# EAGLE design esp32Layout1 (EAGLE 9.6.2)
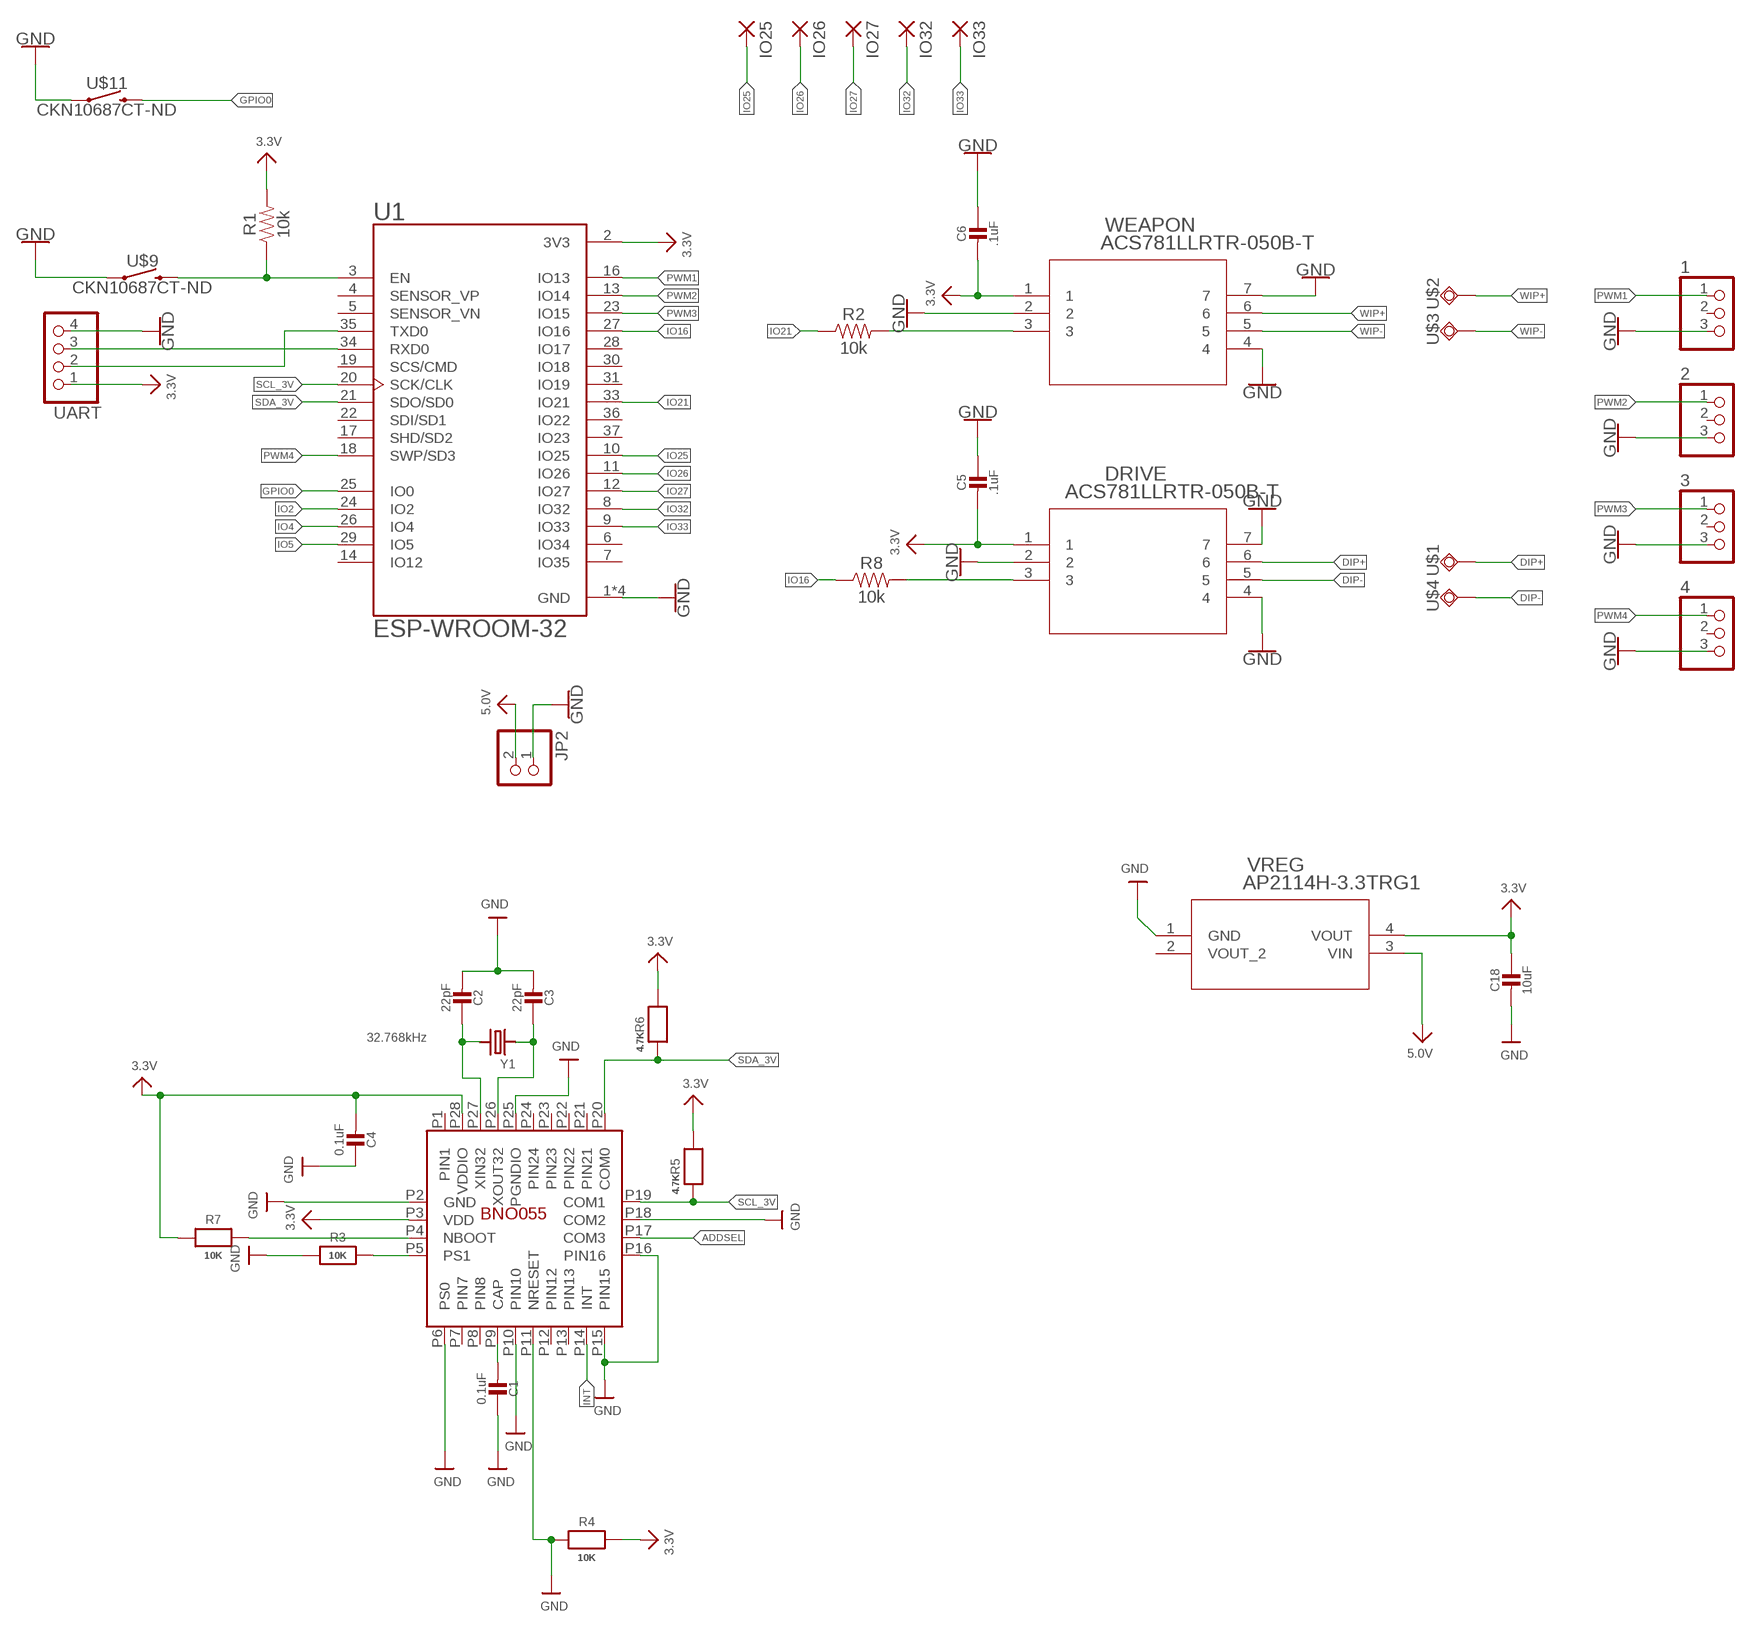
[diagram p0: schematic, sheet 1]

## Parts
1  PINHD-1X3  [1X03]
2  PINHD-1X3  [1X03]
3  PINHD-1X3  [1X03]
4  PINHD-1X3  [1X03]
BNO055  BNO055  [BNO055]
C1  0.1uF  CAP_CERAMIC0805-NOOUTLINE  [0805-NO]
C2  22pF  CAP_CERAMIC0805-NOOUTLINE  [0805-NO]
C3  22pF  CAP_CERAMIC0805-NOOUTLINE  [0805-NO]
C4  0.1uF  CAP_CERAMIC0805-NOOUTLINE  [0805-NO]
C5  .1uF  CAP_CERAMIC0805_10MGAP  [0805_10MGAP]
C6  .1uF  CAP_CERAMIC0805_10MGAP  [0805_10MGAP]
C18  10uF  CAP_CERAMIC0805_10MGAP  [0805_10MGAP]
DRIVE  ACS781LLRTR-050B-T  [PSOF7_ACS781LLRTR-050B-T_ALM]
IO25  SMD2  [SMD1,27-2,54]
IO26  SMD2  [SMD1,27-2,54]
IO27  SMD2  [SMD1,27-2,54]
IO32  SMD2  [SMD1,27-2,54]
IO33  SMD2  [SMD1,27-2,54]
JP2  PINHD-1X2  [1X02]
R1  10k  10KOHM-0603-1/10W-1%  [0603]
R2  10k  10KOHM-0603-1/10W-1%  [0603]
R3  10K  RESISTOR0805_NOOUTLINE  [0805-NO]
R4  10K  RESISTOR0805_NOOUTLINE  [0805-NO]
R5  4.7K  RESISTOR0805_NOOUTLINE  [0805-NO]
R6  4.7K  RESISTOR0805_NOOUTLINE  [0805-NO]
R7  10K  RESISTOR0805_NOOUTLINE  [0805-NO]
R8  10k  10KOHM-0603-1/10W-1%  [0603]
U1  ESP-WROOM-32  [MODULE_ESP-WROOM-32]
U$1  HCURR_PAD  [HCURR_PAD]
U$2  HCURR_PAD  [HCURR_PAD]
U$3  HCURR_PAD  [HCURR_PAD]
U$4  HCURR_PAD  [HCURR_PAD]
U$9  CKN10687CT-ND  [CKN10687CT-ND]
U$11  CKN10687CT-ND  [CKN10687CT-ND]
UART  PINHD-1X4  [1X04]
VREG  AP2114H-3.3TRG1  [SOT-223_DIO]
WEAPON  ACS781LLRTR-050B-T  [PSOF7_ACS781LLRTR-050B-T_ALM]
Y1  32.768kHz  CRYSTAL8.0X3.8  [CRYSTAL_8X3.8]

## Nets
3.3V: BNO055.P3(VDD) BNO055.P28(VDDIO) C4.2 C18.1 R1.2 R4.2 R5.2 R6.2 R7.1 U1.2(3V3) UART.1 VREG.4(VOUT)
5.0V: JP2.2 VREG.3(VIN)
ADDSEL: BNO055.P17(COM3)
DIP+: DRIVE.6 U$1.P$1(TP)
DIP-: DRIVE.5 U$4.P$1(TP)
GND [New Class]: 1.3 2.3 3.3 4.3 BNO055.P2(GND) BNO055.P6(PS0) BNO055.P10(PIN10) BNO055.P11(NRESET) BNO055.P15(PIN15) BNO055.P16(PIN16) BNO055.P18(COM2) BNO055.P25(PGNDIO) C1.1 C2.2 C3.2 C4.1 C5.1 C6.1 C18.2 DRIVE.2 DRIVE.4 DRIVE.7 JP2.1 R3.1 R4.1 U1.1(GND) U1.1.1(GND) U1.15(GND) U1.38(GND) U$9.P$1 U$9.P$2 U$11.P$1 U$11.P$2 UART.4 VREG.1(GND) WEAPON.2 WEAPON.4 WEAPON.7
GPIO0: U1.25(IO0) U$11.P$3 U$11.P$4
INT: BNO055.P14(INT)
IO2: U1.24(IO2)
IO4: U1.26(IO4)
IO5: U1.29(IO5)
IO16: R8.1 U1.27(IO16)
IO21: R2.1 U1.33(IO21)
IO25: IO25.1(P) U1.10(IO25)
IO26: IO26.1(P) U1.11(IO26)
IO27: IO27.1(P) U1.12(IO27)
IO32: IO32.1(P) U1.8(IO32)
IO33: IO33.1(P) U1.9(IO33)
N$1: BNO055.P5(PS1) R3.2
N$2 [New Class]: R1.1 U1.3(EN) U$9.P$3 U$9.P$4
N$3 [New Class]: U1.35(TXD0) UART.2
N$4 [New Class]: U1.34(RXD0) UART.3
N$5: R2.2 WEAPON.3
N$6: BNO055.P9(CAP) C1.2
N$7: BNO055.P27(XIN32) C2.1 Y1.P$4
N$8: BNO055.P26(XOUT32) C3.1 Y1.P$1
N$9: BNO055.P4(NBOOT) R7.2
N$10: DRIVE.3 R8.2
N$11: C5.2 DRIVE.1 ; supply symbol labelled 3.3V
N$12 [New Class]: C6.2 WEAPON.1 ; supply symbol labelled 3.3V
PWM1: 1.1 U1.16(IO13)
PWM2: 2.1 U1.13(IO14)
PWM3: 3.1 U1.23(IO15)
PWM4: 4.1 U1.18(SWP/SD3)
SCL_3V: BNO055.P19(COM1) R5.1 U1.20(SCK/CLK)
SDA_3V: BNO055.P20(COM0) R6.1 U1.21(SDO/SD0)
WIP+: U$2.P$1(TP) WEAPON.6
WIP-: U$3.P$1(TP) WEAPON.5
Unconnected: 1.2 2.2 3.2 4.2 BNO055.P1(PIN1) BNO055.P7(PIN7) BNO055.P8(PIN8) BNO055.P12(PIN12) BNO055.P13(PIN13) BNO055.P21(PIN21) BNO055.P22(PIN22) BNO055.P23(PIN23) BNO055.P24(PIN24) U1.4(SENSOR_VP) U1.5(SENSOR_VN) U1.6(IO34) U1.7(IO35) U1.14(IO12) U1.17(SHD/SD2) U1.19(SCS/CMD) U1.22(SDI/SD1) U1.28(IO17) U1.30(IO18) U1.31(IO19) U1.36(IO22) U1.37(IO23) VREG.2(VOUT_2)

## Library data of the parts
1-4 = pinhead:PINHD-1X3: PIN HEADER
BNO055 = Tim Parts:BNO055
C1-C6 C18 = microbuilder:CAP_CERAMIC: Ceramic Capacitors For new designs, use the packages preceded by an '_' character since they are more reliable: The following footprints should be used on most boards: _0402 - Standard footprint for regular board layouts _0603 - Standard footprint for regular board layouts _0805 - Standard footprint for regular board layouts _1206 - Standard footprint for regular board layouts For extremely tight-pitch boards where space is at a premium, the following 'micro-pitch' footprints can be used (smaller pads, no silkscreen outline, etc.): _0402MP - Micro-pitch footprint for very dense/compact boards _0603MP - Micro-pitch footprint for very dense/compact boards _0805MP - Micro-pitch footprint for very dense/compact boards _1206MP - Micro-pitch footprint for very dense/compact boards
DRIVE WEAPON = Bell Parts:ACS781LLRTR-050B-T; BUILT_BY: EMA_Kyle; COPYRIGHT: Copyright (C) 2018 Accelerated Designs. All rights reserved; MANUFACTURER_PART_NUMBER: ACS781LLRTR-050B-T; SOURCELIBRARY: Allegro_Microsystems_Inc_2020-02-13; VENDOR: Allegro Microsystems Inc.
IO25-IO27 IO32 IO33 = wirepad:SMD2: SMD PAD
JP2 = pinhead:PINHD-1X2: PIN HEADER
R1 R2 R8 = SparkFun-Resistors:10KOHM: 10kΩ resistor A resistor is a passive two-terminal electrical component that implements electrical resistance as a circuit element. Resistors act to reduce current flow, and, at the same time, act to lower voltage levels within circuits. - Wikipedia; PROD_ID: RES-00824
R3-R7 = microbuilder:RESISTOR: Resistors For new designs, use the packages preceded by an '_' character since they are more reliable: The following footprints should be used on most boards: _0402 - Standard footprint for regular board layouts _0603 - Standard footprint for regular board layouts _0805 - Standard footprint for regular board layouts _1206 - Standard footprint for regular board layouts For extremely tight-pitch boards where space is at a premium, the following 'micro-pitch' footprints can be used (smaller pads, no silkscreen outline, etc.): _0402MP - Micro-pitch footprint for very dense/compact boards _0603MP - Micro-pitch footprint for very dense/compact boards _0805MP - Micro-pitch footprint for very dense/compact boards _1206MP - Micro-pitch footprint for very dense/compact boards
U1 = ESP-WROOM-32:ESP-WROOM-32: Module: combo; GPIO, I2C x2, I2S x2, SDIO, SPI x3, UART x3; 19.5dBm; AVAILABILITY: Unavailable; DESCRIPTION: WiFi 802.11b/g/n/d/e/i Transceiver Module 2.4GHz Surface Mount; MF: Olimex LTD; MP: ESP-WROOM-32; PACKAGE: Module Olimex LTD; PRICE: None
U$1-U$4 = Bell Parts:HCURR_PAD
U$9 U$11 = Bell Parts:CKN10687CT-ND
UART = pinhead:PINHD-1X4: PIN HEADER
VREG = Bell Parts:AP2114H-3.3TRG1; BUILT_BY: EMA_UL_Team; MANUFACTURER_PART_NUMBER: AP2114H-3.3TRG1; SOURCELIBRARY: DIODESINC_2_2015-08-18; VENDOR: Diodes Inc
Y1 = microbuilder:CRYSTAL: Crystals HC49UP - Surface Mount Crystal 4.0MHz 18pF +/-30ppm Surface Mount Crystal [Digikey: 535-9857-1-ND] 12.0 MHz Surface Mount Crystal [Digikey: 535-9869-6-ND] 25.0 MHz Surface Mount Crystal [Digikey: 535-9078-1-ND] 2.5 x 2.0mm - MEMs SMT Crystal 16.0 MHz 10pF 20ppm 2.5 x 2.0mm Crystal [Digikey -40-85°C: 535-10923-1-ND] 3.2 x 2.5mm - MEMs SMT Crystal 12.0 MHz 8pF 15ppm 3.2 x 2.5mm Crystal [Digikey: -10-70°C: 644-1047-1-ND -40-125°C: 644-1128-1-ND] 40~85°C cheaper: 644-1173-6-ND 16.0 MHz 8pF 15ppm 3.2 x 2.5mm Crystal [Digikey: -10-70°C: 644-1049-1-ND -40-125°C: 644-1129-2-ND]-40~85°C cheaper: 644-1175-6-ND 16.0 MHz 10pF 10ppm 3.2 x 2.5mm Crystal [Digikey: 644-1100-1-ND] 27.12 MHz 18pF 30ppm 3.2 x 2.5mm Crystal [Digikey: 887-1424-1-ND] 27.12MHz 10pF 10ppm 3.2 x 2.5mm Crystal [Digikey: 887-1329-1-ND] 4.9 x 1.8mm - MEMs SMT Crystal 32.768 KHz 12.5pF 20ppm 4.9 x 1.8mm Crystal [Digikey: SE2415CT-ND] 8.0 x 3.8mm - Surface Mount Crystal 32.768kHz 12.5pF 20ppm -40°C-85°C [Digikey: 535-9166-2-ND] Cylinder 32.768KHz Cylinder Crystal (2x6mm body) [Ex. Digikey: 300-8341-2-ND]

## Net classes
1 New Class: width 0.152 mm, drill 0.254 mm, clearance 0.254 mm

## Board
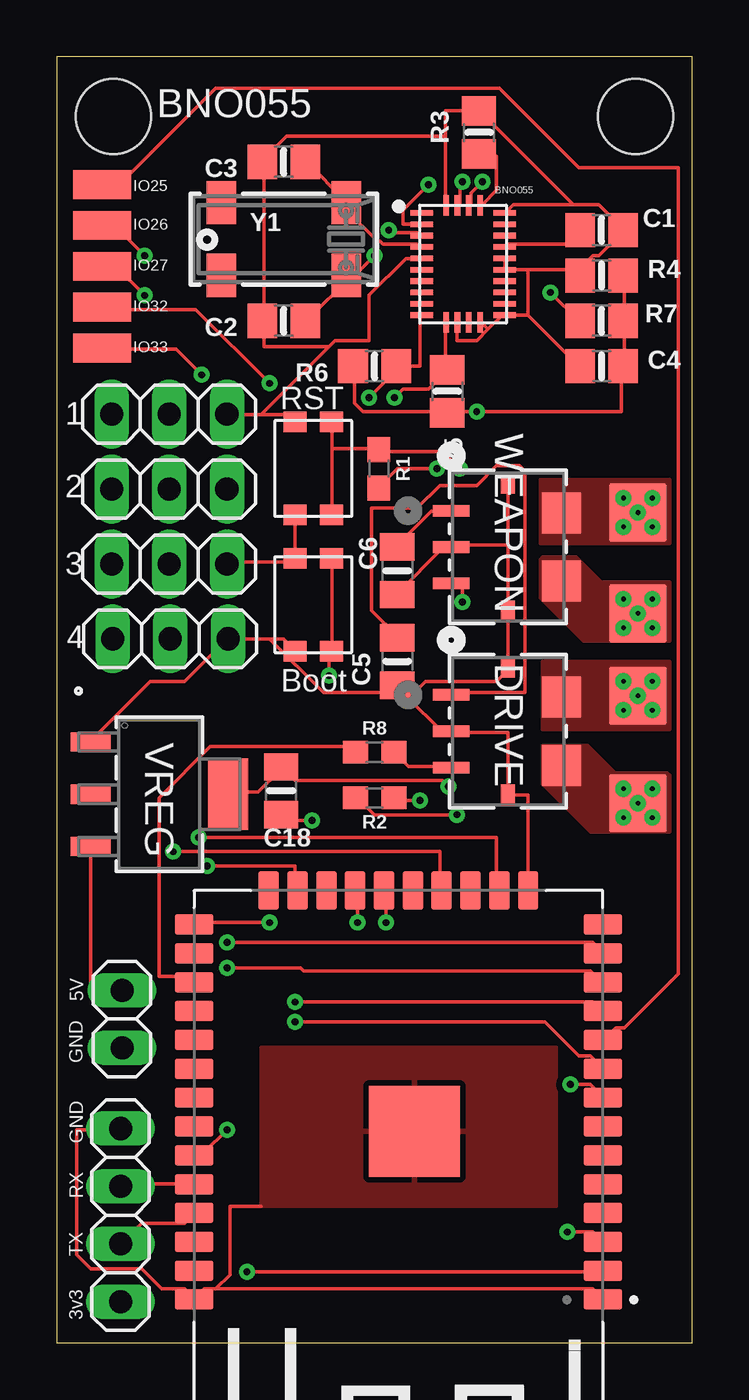
[diagram p1: board, top side]
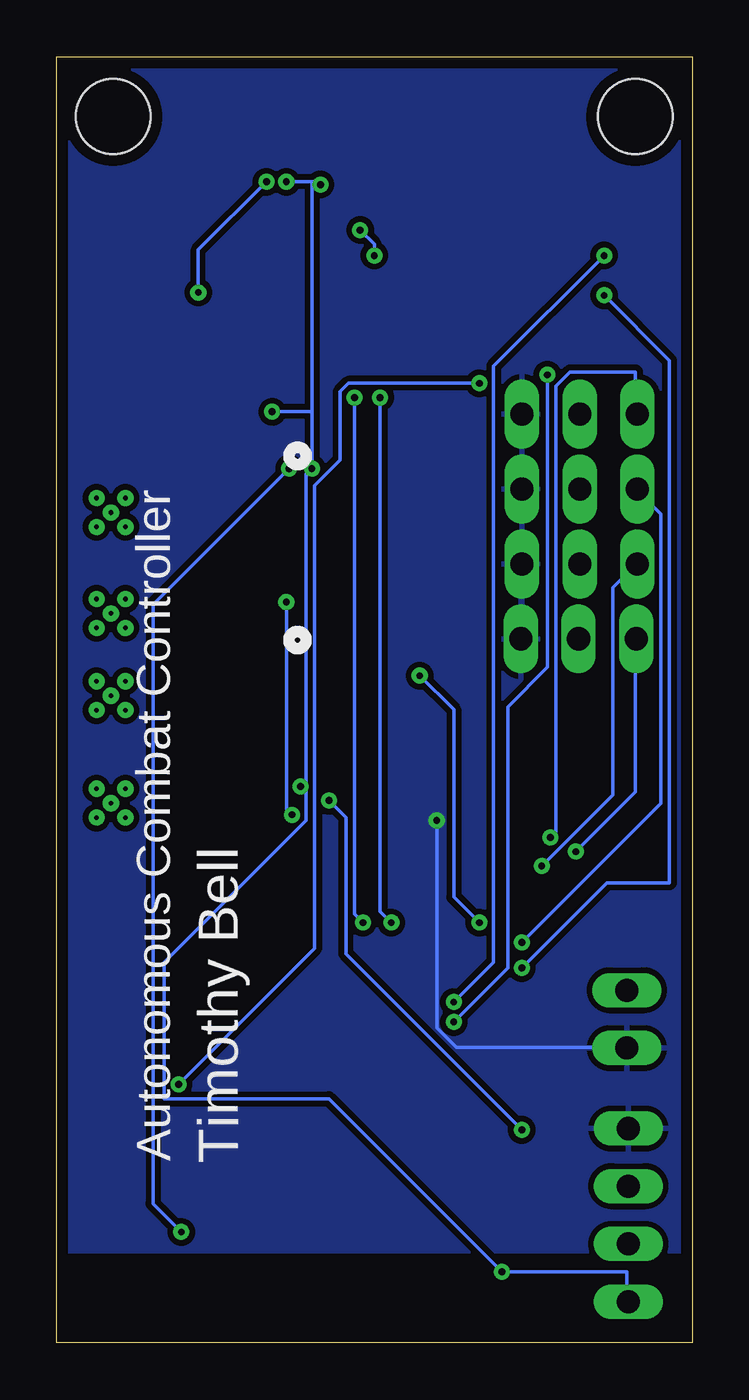
[diagram p2: board, bottom side, seen from below]

Size 27.99 x 56.63 mm. Coordinates in mm from the lower left corner, seen from the top.
Outline: 0,0 27.99,0 27.99,56.63 0,56.63 0,0
Copper layers (1*16): Top 0.035mm / dielectric 1.5mm / Bottom 0.035mm
Design rules "JLC 2 layer DRC": minimum track width 6mil, minimum drill 0.3mm, track to track 6mil, track to pad 6mil, pad to pad 6mil, via to via 6mil, smd to smd 6mil, copper to edge 20mil, drill to drill 6mil, minimum pad ring 10mil, minimum via ring 8mil, stop-mask expansion 4mil, vias tented up to drill 0mil, thermal gap 10mil
Holes 3.3 mm at 2.5,54 25.5,54

### Footprints (pad centres in the part's own frame; a part is rotated, then mirrored left to right if it is on the bottom)
1X03 = drill 1.016 long: 1 -2.54,0; 2 0,0; 3 2.54,0
BNO055 = smd 0.25 x 1: P1 2.25,1.825; P6 2.25,-1.825; P7 1.75,-1.825; P8 1.25,-1.825; P9 0.75,-1.825; P10 0.25,-1.825; P11 -0.25,-1.825; P12 -0.75,-1.825; P13 -1.25,-1.825; P14 -1.75,-1.825; P15 -2.25,-1.825; P20 -2.25,1.825; P21 -1.75,1.825; P22 -1.25,1.825; P23 -0.75,1.825; P24 -0.25,1.825; P25 0.25,1.825; P26 0.75,1.825; P27 1.25,1.825; P28 1.75,1.825 | smd 0.9 x 0.25: P2 2.575,0.75; P3 2.575,0.25; P4 2.575,-0.25; P5 2.575,-0.75; P16 -2.575,-0.75; P17 -2.575,-0.25; P18 -2.575,0.25; P19 -2.575,0.75
0805-NO = smd 1.3 x 1.5: 1 -0.95,0; 2 0.95,0
0805_10MGAP = smd 1.2 x 1.5: 1 -1.05,0; 2 1.05,0
PSOF7_ACS781LLRTR-050B-T_ALM = smd 0.508 x 1.6: 1 -3.2,0; 2 -1.6,0; 3 0,0 | smd 0.889 x 0.61: 4 1.2,2.5; 7 -4.4,2.5 | smd 1.803 x 1.702: 5 -0.1,4.85; 6 -3.1,4.85
SMD1,27-2,54 = smd 1.27 x 2.54: 1 0,0
1X02 = drill 1.016 long: 1 -1.27,0; 2 1.27,0
0603 = smd 1.1 x 1: 1 -0.85,0; 2 0.85,0
MODULE_ESP-WROOM-32 = smd 1.7 x 0.9: 1 -9,8.255; 2 -9,6.985; 3 -9,5.715; 4 -9,4.445; 5 -9,3.175; 6 -9,1.905; 7 -9,0.635; 8 -9,-0.635; 9 -9,-1.905; 10 -9,-3.175; 11 -9,-4.445; 12 -9,-5.715; 13 -9,-6.985; 14 -9,-8.255; 25 9,-8.255; 26 9,-6.985; 27 9,-5.715; 28 9,-4.445; 29 9,-3.175; 30 9,-1.905; 31 9,-0.635; 32 9,0.635; 33 9,1.905; 34 9,3.175; 35 9,4.445; 36 9,5.715; 37 9,6.985; 38 9,8.255 | smd 4 x 4: 1.1 -0.7,0.845 | smd 0.9 x 1.7: 15 -5.715,-9.755; 16 -4.445,-9.755; 17 -3.175,-9.755; 18 -1.905,-9.755; 19 -0.635,-9.755; 20 0.635,-9.755; 21 1.905,-9.755; 22 3.175,-9.755; 23 4.445,-9.755; 24 5.715,-9.755
HCURR_PAD = smd 2.54 x 2.54: P$1 0,0 | drill 0.203 pad 0.406: P$2 -0.635,0.635; P$3 0.635,0.635; P$4 -0.635,-0.635; P$5 0.635,-0.635; P$6 0,0
CKN10687CT-ND = smd 0.9 x 1: P$1 0.45,0.5; P$2 4.55,0.5; P$3 4.55,2.1; P$4 0.45,2.1
1X04 = drill 1.016 long: 1 -3.81,0; 2 -1.27,0; 3 1.27,0; 4 3.81,0
SOT-223_DIO = smd 0.851 x 1.761: 1 -2.3,-3.025; 2 0,-3.025; 3 2.3,-3.025 | smd 3.151 x 1.761: 4 0,3.025
CRYSTAL_8X3.8 = smd 1.3 x 1.9: P$1 -2.75,-1.6; P$2 2.75,-1.6; P$3 2.75,1.6; P$4 -2.75,1.6

### Placement (x,y rotation side)
1  4.95,40.89 0 top
2  4.95,37.59 0 top
3  4.95,34.29 0 top
4  5,31 0 top
BNO055  17.9,47.5 90 top
C1  24,49 180 top
C2  10,45 180 top
C3  10,52 180 top
C4  24,43 0 top
C5  15,30 90 top
C6  15,34 90 top
C18  9.88,24.3 270 top
DRIVE  17.38,25.33 270 top
IO25  2,51 90 top
IO26  2,49.2 90 top
IO27  2,47.4 90 top
IO32  2,45.6 90 top
IO33  2,43.8 90 top
JP2  2.87,14.25 90 top
R1  14.19,38.49 270 top
R2  14,24 180 top
R3  18.6,53.3 270 top
R4  24,47 0 top
R5  17.2,41.9 270 top
R6  14,43 180 top
R7  24,45 180 top
R8  14,26 0 top
U1  15.05,10.16 180 top
U$1  25.6,28.49 0 top
U$2  25.6,36.56 180 top
U$3  25.6,32.12 0 top
U$4  25.6,23.76 0 top
U$9  10,41 270 top
U$11  10,35 270 top
UART  2.81,5.62 90 top
VREG  4.51,24.16 270 top
WEAPON  17.38,33.44 270 top
Y1  10,48.6 180 top

### Tracks (layer width: path | path; a pad name or v marks a point on that pad's centre or on a via)
3.3V  (via drill 0.3)
  Top 0.152: v8.38,3.12 24,3.12 U1.2 | 25,45 25,43 C4.2 24.88,43 24.88,41 v18.5,41 17.25,41 R5.2 17.12,41 13.5,41 13.12,41.38 13.12,43 R6.2 | 25,45 25,47 R4.2 | 25,45 R7.1 | VREG.4 7.62,24.25 8.88,24.25 9.88,25.25 C18.1 10,25.25 10.5,24.75 17,24.75 v17.25,24.5 | v17.88,51.12 17.75,51.12 17.75,50.12 BNO055.P3 | v16.38,51 15.25,49.88 15.25,49.25 BNO055.P28 | v16.75,38.5 15,38.5 14.25,37.75 R1.2
  Bottom 0.152: UART.1 2.88,1.88 2.88,3.12 v8.38,3.12 16,10.75 23.25,10.75 23.25,16.75 17,23 17,24.75 | 16.75,51.12 16.38,51.12 v16.38,51 | 16.75,51.12 v17.88,51.12 | 16.75,51.12 16.75,41 | 16.75,41 v16.75,38.5 17,38.25 17,24.75 | 17,24.75 v17.25,24.5 | 16.75,41 v18.5,41
5.0V
  Top 0.152: VREG.3 1.5,21.75 1.5,15.62 2.75,15.62 JP2.2
DIP+
  pour Top (no thermals): 21.4,30 21.4,27 27,27 27,30
DIP-
  pour Top (no thermals): 21.4,26.3 21.4,24.6 23.5,22.5 27,22.5 27,25 26.9,25.1 24.6,25.1 23.4,26.3
GND  (via drill 0.3)
  Top 0.152: 19.88,35.12 19.88,37.75 WEAPON.7 | 19.88,35.12 17.5,35.12 WEAPON.2 17.38,35 17,35 15,33 C6.1 | 19.88,35.12 WEAPON.4 19.88,32.12 19.88,29.75 DRIVE.7 19.88,29.62 19.38,29.12 16.25,29.12 15.5,28.38 | 15.5,28.38 16.88,27 17.38,27 DRIVE.2 17.5,26.88 19.88,26.88 19.88,24.25 DRIVE.4 20,24.12 20.75,24.12 20.75,20 U1.15 | 15.5,28.38 15,28.88 | 15.5,28.38 C5.1 15,28.88 | 7,2.38 6.5,2.38 6.12,2 U1.38 6,2 5.62,2.38 4.62,2.38 3.75,3.25 1.5,3.25 0.88,3.88 0.88,9.38 2.75,9.38 UART.4 | 7,2.38 7.62,3 7.62,6 9,6 | 7,2.38 23.62,2.38 24,2 U1.1 | 19.75,47.25 19.75,47.75 BNO055.P10 | 20.75,47.25 22.75,47.25 22.88,47.12 | 20.75,47.25 19.75,47.25 | 22.88,47.12 23,47 R4.1 22.88,47.12 | 19.75,47.25 BNO055.P11 | 19,44.62 19.62,45.25 BNO055.P15 20.75,45.25 | 19,44.62 18.5,44.12 17.62,44.12 17.62,44.88 BNO055.P18 | 19,44.62 18.75,44.88 BNO055.P16 | 20.75,45.25 23,43 C4.1 | 20.75,45.25 20.75,47.25 | 17.12,53.12 17.12,54.25 R3.1 18.62,54.25 22.75,50.12 | 17.12,53.12 17.12,50.12 BNO055.P2 | 22.75,50.12 23.88,50.12 25,49 | 22.75,50.12 20.12,50.12 19.75,49.75 BNO055.P6 | 22.88,47.12 23.62,47.88 23.88,47.88 25,49 | 25,49 C1.1 | U$9.P$2 U$11.P$1 10.5,34.5 10.38,34.38 7.5,34.38 3.3 | 9.38,31 4.3 7.5,31 5.62,29.12 4.12,29.12 1.5,26.5 VREG.1 | 9.38,31 10,31 10.5,30.5 U$11.P$2 | 9,40.88 7.5,40.88 1.3 | 9,40.88 10.25,40.88 10.5,40.62 U$9.P$1 | BNO055.P25 15.38,47.75 13.75,46.12 13.75,44.12 12.25,44.12 12,43.88 | 9,40.88 12,43.88 | 9.12,45 9.12,43.88 12,43.88 | 9.12,45 9.12,52 C3.2 9,52 10.12,53.12 17.12,53.12 | 9.12,45 C2.2 | v11.25,23 10.25,23 10,23.25 C18.2 | 15,28.88 14.75,28.62 11.75,28.62 9.38,31
  Bottom 0.152: v11.25,23 11.25,13.88 10.38,13 2.88,13 JP2.1
  pour Bottom (rank 6): 0,56.5 0,4 28,4 28,56.5
  pour Top (rank 5): 9,12 9,6 22,6 22,13 9,13
GPIO0  (via drill 0.3)
  Top 0.152: U$11.P$4 12.12,34.5 12.12,30.5 U$11.P$3 12,30.38 v12,29.38 | v9.38,18.5 6.12,18.5 U1.25
  Bottom 0.152: v9.38,18.5 10.5,19.62 10.5,27.88 v12,29.38
IO16
  Top 0.152: R8.1 13.12,26 12.88,26.25 6.75,26.25 4.5,24 4.5,16.12 5.75,16.12 6,15.88 U1.27
IO21  (via drill 0.3)
  Top 0.152: v16,23.88 15,23.88 14.88,24 R2.1 | v7.5,9.38 6.5,8.38 6.12,8.38 U1.33
  Bottom 0.152: v16,23.88 15.25,23.12 15.25,17.12 v7.5,9.38
IO25
  Top 0.152: IO25.1 2.75,51 7,55.25 19.5,55.25 23,51.75 27.38,51.75 27.38,16.25 25,13.88 24.62,13.88 24.12,13.38 U1.10
IO26  (via drill 0.3)
  Top 0.152: v10.5,15 23.62,15 24,14.62 U1.11 | v3.88,47.88 2.62,49.12 2,49.12 IO26.1
  Bottom 0.152: v10.5,15 8.75,16.75 8.75,43 v3.88,47.88
IO27  (via drill 0.3)
  Top 0.152: v7.5,16.5 10.75,16.5 10.88,16.38 23.5,16.38 24,15.88 U1.12 | v3.88,46.12 2.62,47.38 2,47.38 IO27.1
  Bottom 0.152: v7.5,16.5 3.75,20.25 1,20.25 1,43.25 v3.88,46.12
IO32  (via drill 0.3)
  Top 0.152: v22.62,11.38 23.5,11.38 24,10.88 U1.8 | v9.38,42.25 6.12,45.5 2,45.5 IO32.1
  Bottom 0.152: v22.62,11.38 16.62,17.38 16.62,37.75 15.5,38.88 15.5,41.88 15.12,42.25 v9.38,42.25
IO33  (via drill 0.3)
  Top 0.152: v10.5,14.12 21.5,14.12 23,12.62 23.5,12.62 24,12.12 U1.9 | v6.38,42.62 5.25,43.75 2,43.75 IO33.1
  Bottom 0.152: v10.5,14.12 8.12,16.5 8.12,28 6.38,29.75 v6.38,42.62
N$1
  Top 0.152: BNO055.P5 18.75,50.12 19.38,50.75 19.38,52.25 18.62,52.25 R3.2
N$2  (via drill 0.3)
  Top 0.152: 12.12,39.38 12.12,40.5 U$9.P$4 | 12.12,39.38 12.12,36.5 U$9.P$3 | 12.12,39.38 14.12,39.38 R1.1 14.25,39.25 17,39.25 v17.75,38.5 | v22.5,4.88 23.62,4.88 24,4.5 U1.3
  Bottom 0.152: v22.5,4.88 23.75,6.12 23.75,32.5 v17.75,38.5
N$3
  Top 0.152: U1.35 6,5.62 5.62,5.25 3.75,5.25 2.88,4.38 UART.2
N$4
  Top 0.152: U1.34 6,7 2.88,7 UART.3
N$5  (via drill 0.3)
  Top 0.152: v17.62,23.25 14,23.25 13.25,24 R2.2 | v17.88,32.62 17.88,33.38 17.5,33.38 WEAPON.3
  Bottom 0.152: v17.62,23.25 17.88,23.5 v17.88,32.62
N$6
  Top 0.152: BNO055.P9 19.75,48.25 19.88,48.38 22.38,48.38 23,49 C1.2
N$7  (via drill 0.3)
  Top 0.152: v14.62,49 14.75,48.88 15.88,48.88 16,48.75 BNO055.P27 | v14,47.88 13.12,47 13,47 | 13,47 11,45 C2.1 | 13,47 Y1.P$4
  Bottom 0.152: v14.62,49 14,48.38 v14,47.88
N$8
  Top 0.152: BNO055.P26 16,48.25 15.88,48.38 14.38,48.38 14.25,48.5 14.12,48.5 12.75,49.88 Y1.P$1 12.75,50.25 11,52 C3.1
N$9  (via drill 0.3)
  Top 0.152: v18.75,51.12 18.25,50.62 18.25,50.12 BNO055.P4 | v21.75,46.25 23,45 R7.2
  Bottom 0.152: v18.75,51.12 21.75,48.12 v21.75,46.25
N$10
  Top 0.152: R8.2 14.88,26 15.5,25.38 17.38,25.38 DRIVE.3
N$11
  Top 0.152: C5.2 15,31.12 13.88,32.25 13.88,36.75 15.88,36.75 16.88,37.75 18.5,37.75 19.38,38.62 20.38,38.62 20.62,38.38 20.62,28.62 17.5,28.62 DRIVE.1
N$12
  Top 0.152: C6.2 15,35.12 16.5,36.62 17.38,36.62 WEAPON.1
PWM1  (via drill 0.3)
  Top 0.152: v6.25,22.25 19.38,22.25 19.38,20 U1.16
  Bottom 0.152: v6.25,22.25 6,22.5 6,42.12 5.38,42.75 2.5,42.75 2.5,41 1.1
PWM2  (via drill 0.3)
  Top 0.152: v7.5,17.62 23.62,17.62 24,17.25 U1.13
  Bottom 0.152: v7.5,17.62 1.38,23.75 1.38,36.5 2.38,37.5 2.1
PWM3  (via drill 0.3)
  Top 0.152: v6.62,21 10.5,21 10.5,20 U1.23
  Bottom 0.152: v6.62,21 3.5,24.12 3.5,33.25 2.5,34.25 3.1
PWM4  (via drill 0.3)
  Top 0.152: v5.12,21.62 16.88,21.62 16.88,20 U1.18
  Bottom 0.152: v5.12,21.62 2.5,24.25 2.5,31 4.1
SCL_3V  (via drill 0.3)
  Top 0.152: BNO055.P19 17.12,44.88 17.12,42.88 R5.1 17.12,42.75 16.38,42 15.25,42 v14.88,41.62 | v14.5,18.5 14.5,19.88 U1.20
  Bottom 0.152: v14.5,18.5 14.88,18.88 v14.88,41.62
SDA_3V  (via drill 0.3)
  Top 0.152: R6.1 15.12,43 | 15.12,43 16,43 16,45.25 BNO055.P20 | v13.25,18.5 13.25,19.88 U1.21 | 15.12,43 v13.75,41.62
  Bottom 0.152: v13.25,18.5 13.75,19 v13.75,41.62
WIP+
  pour Top (rank 2, no thermals): 21.3,38 21.3,35.2 27,35.2 27,38
WIP-
  pour Top (rank 3, no thermals): 27,30.9 23.2,30.9 21.3,32.8 21.3,34.5 21.4,34.6 22.9,34.6 24,33.5 27,33.5

### Text on the board
tPlace: BNO055 | RST | Boot | 5V | GND | GND | RX | TX | 3v3
bPlace: Timothy Bell | Autonomous Combat Controller